# Altium project Olimp_hub_short.PrjPcb
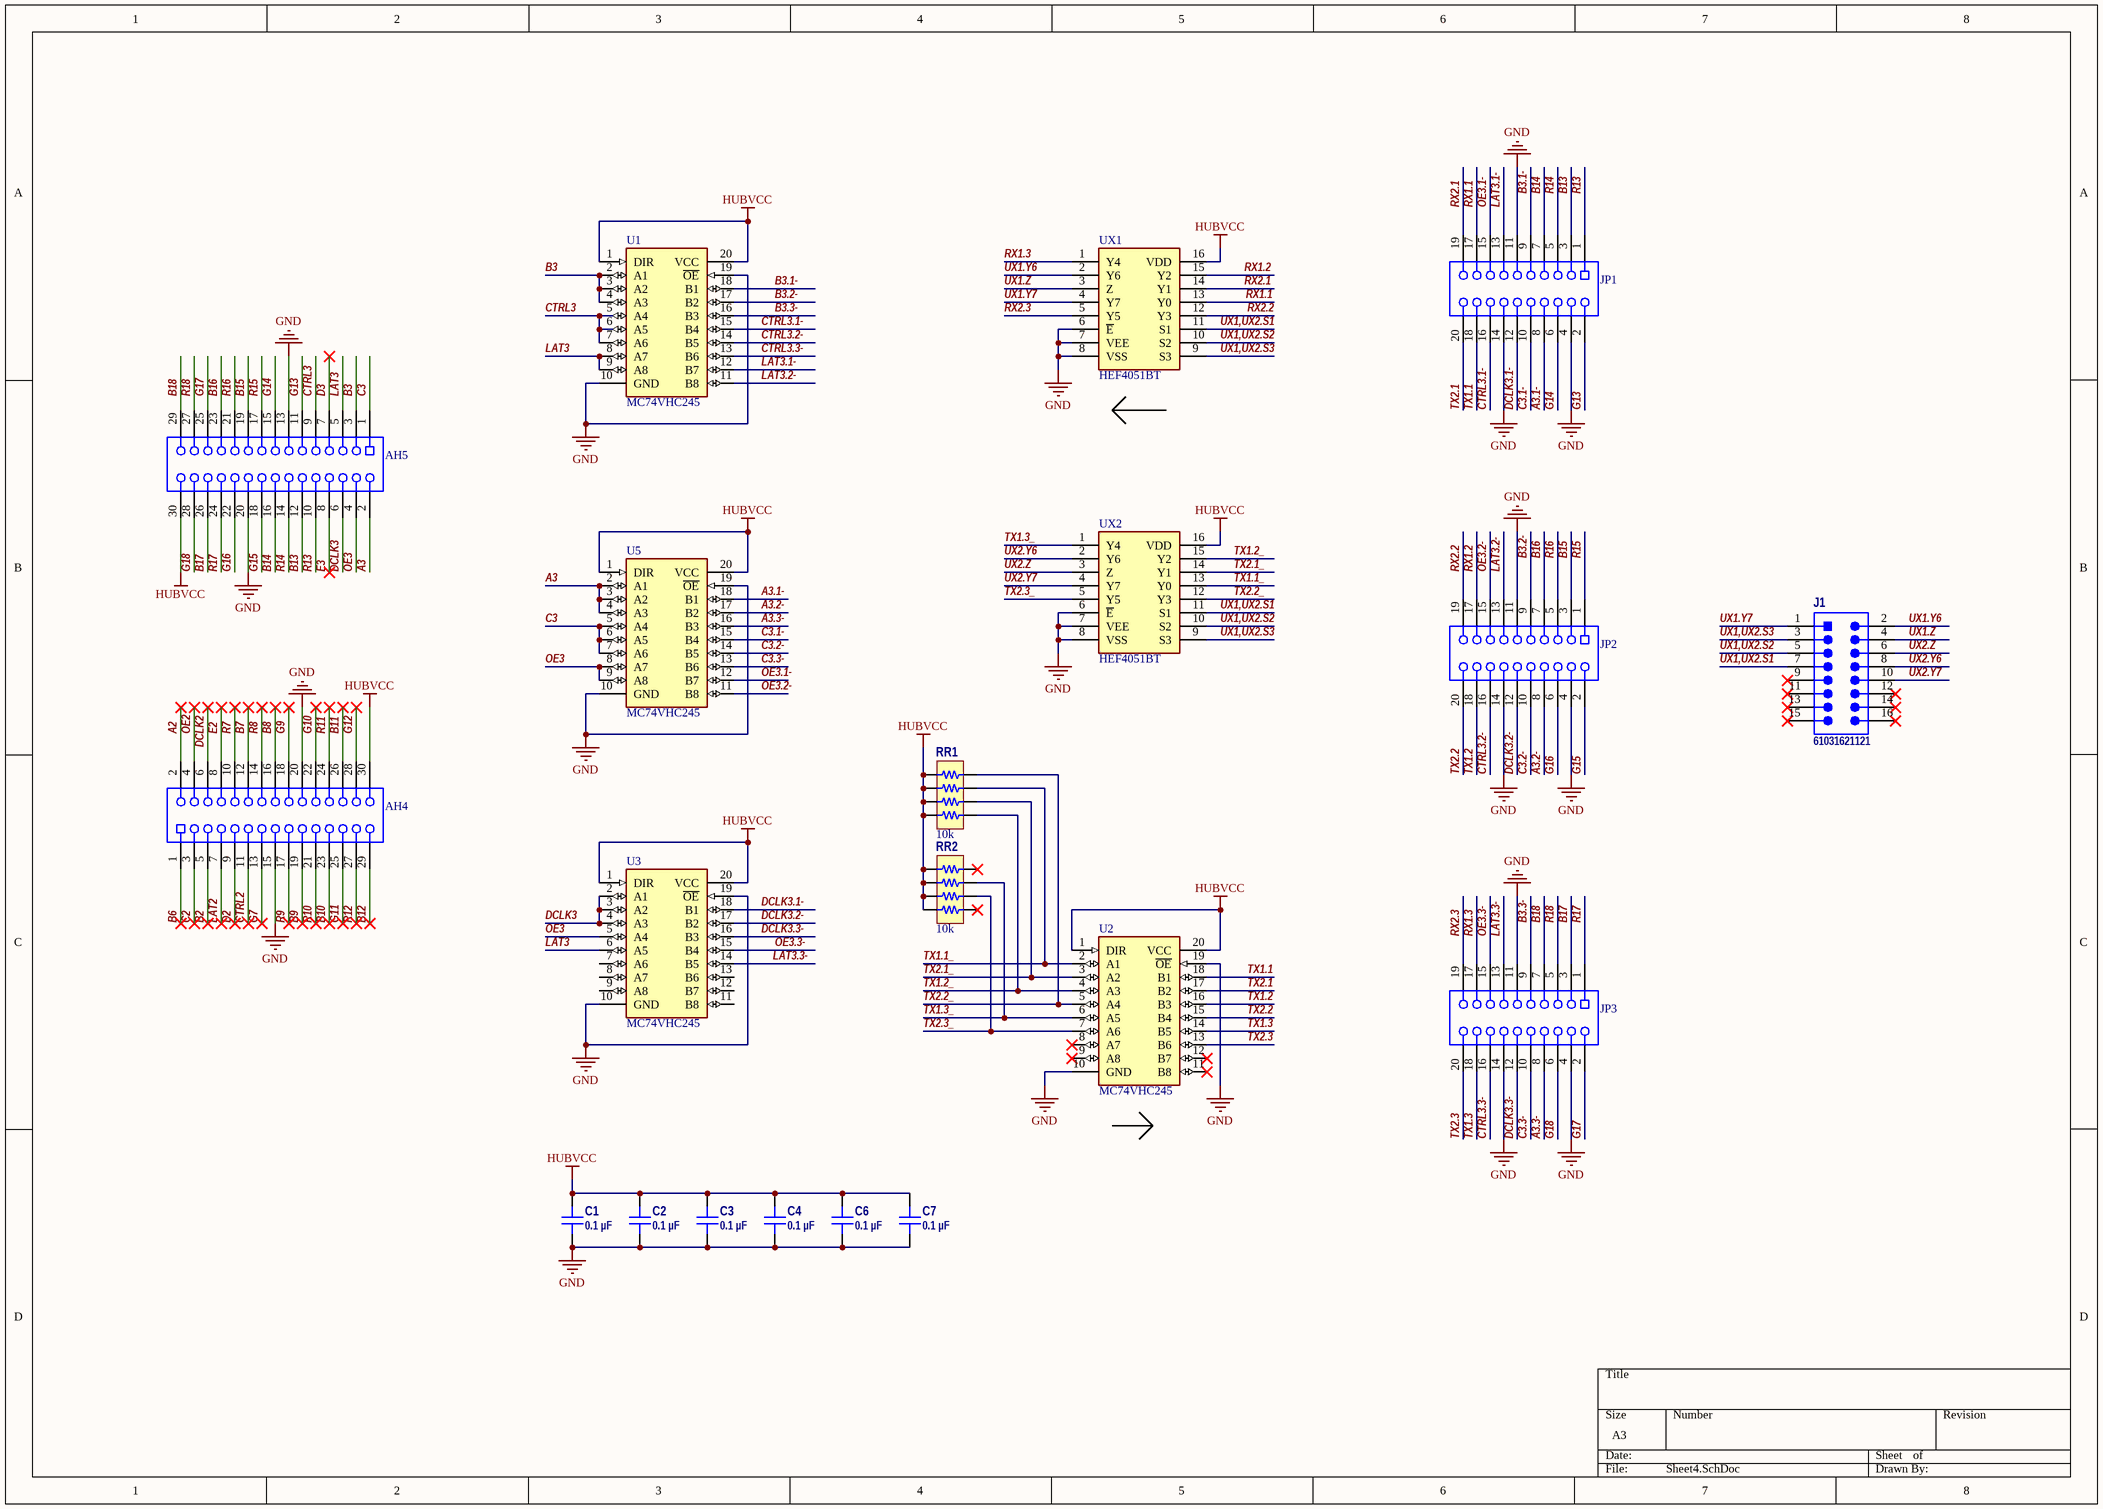
[diagram p0: Sheet4.SchDoc]
1 sheet, 20 parts. Net scope: global (net labels, ports and power ports of the same name join across sheets).
Board file: PCB1.PcbDoc

## Sheet Sheet4.SchDoc
size A3; SheetNumber: 1; SheetTotal: 1

### Parts
AH4  61003021821  [61003021821]  (value not drawn)
AH5  61003021821  [61003021821]  (value not drawn)
C1  0.1 µF  [CAP 0603_1608]
C2  0.1 µF  [CAP 0603_1608]
C3  0.1 µF  [CAP 0603_1608]
C4  0.1 µF  [CAP 0603_1608]
C6  0.1 µF  [CAP 0603_1608]
C7  0.1 µF  [CAP 0603_1608]
J1  61031621121  [61031621121]
JP1  61002021821  [61002021821]  (value not drawn)
JP2  61002021821  [61002021821]  (value not drawn)
JP3  61002021821  [61002021821]  (value not drawn)
RR1  Resistance (Ohms): 10k  [RESNET 0804-8 CONVEX]  (hidden comment: YC124-JR-0710KL)
RR2  Resistance (Ohms): 10k  [RESNET 0804-8 CONVEX]  (hidden comment: YC124-JR-0710KL)
U1  MC74VHC245  [SOP65P640X120-20N]
U2  MC74VHC245  [SOP65P640X120-20N]
U3  MC74VHC245  [SOP65P640X120-20N]
U5  MC74VHC245  [SOP65P640X120-20N]
UX1  HEF4051BT  [SOIC127P600X175-16N]
UX2  HEF4051BT  [SOIC127P600X175-16N]

### Nets
GND: AH4.15 AH4.20 AH5.13 AH5.20 C1.2 C2.2 C3.2 C4.2 C6.2 C7.2 JP1.4 JP1.11 JP1.14 JP2.4 JP2.11 JP2.14 JP3.4 JP3.11 JP3.14 U1.10(GND) U1.19(~{OE}) U2.10(GND) U2.19(~{OE}) U3.10(GND) U3.19(~{OE}) U5.10(GND) U5.19(~{OE}) UX1.6(~{E}) UX1.7(VEE) UX1.8(VSS) UX2.6(~{E}) UX2.7(VEE) UX2.8(VSS)
HUBVCC: AH4.30 AH5.30 C1.1 C2.1 C3.1 C4.1 C6.1 C7.1 RR1.5 RR1.6 RR1.7 RR1.8 RR2.5 RR2.6 RR2.7 RR2.8 U1.1(DIR) U1.20(VCC) U2.1(DIR) U2.20(VCC) U3.1(DIR) U3.20(VCC) U5.1(DIR) U5.20(VCC) UX1.16(VDD) UX2.16(VDD)
A2: AH4.2
A3: AH5.2 U5.2(A1) U5.3(A2) U5.4(A3)
A3.1-: JP1.8 U5.18(B1)
A3.2-: JP2.8 U5.17(B2)
A3.3-: JP3.8 U5.16(B3)
B2: AH4.5
B3: AH5.3 U1.2(A1) U1.3(A2) U1.4(A3)
B3.1-: JP1.9 U1.18(B1)
B3.2-: JP2.9 U1.17(B2)
B3.3-: JP3.9 U1.16(B3)
B6: AH4.1
B7: AH4.12
B8: AH4.16
B9: AH4.19
B10: AH4.23
B11: AH4.26
B12: AH4.29
B13: AH5.12 JP1.3
B14: AH5.16 JP1.7
B15: AH5.19 JP2.3
B16: AH5.23 JP2.7
B17: AH5.26 JP3.3
B18: AH5.29 JP3.7
C2: AH4.3
C3: AH5.1 U5.5(A4) U5.6(A5) U5.7(A6)
C3.1-: JP1.10 U5.15(B4)
C3.2-: JP2.10 U5.14(B5)
C3.3-: JP3.10 U5.13(B6)
CTRL2: AH4.11
CTRL3: AH5.9 U1.5(A4) U1.6(A5) U1.7(A6)
CTRL3.1-: JP1.16 U1.15(B4)
CTRL3.2-: JP2.16 U1.14(B5)
CTRL3.3-: JP3.16 U1.13(B6)
D2: AH4.9
D3: AH5.7
DCLK2: AH4.6
DCLK3: AH5.6 U3.2(A1) U3.3(A2) U3.4(A3)
DCLK3.1-: JP1.12 U3.18(B1)
DCLK3.2-: JP2.12 U3.17(B2)
DCLK3.3-: JP3.12 U3.16(B3)
E2: AH4.8
E3: AH5.8
G7: AH4.13
G9: AH4.18
G10: AH4.22
G11: AH4.25
G12: AH4.28
G13: AH5.11 JP1.2
G14: AH5.15 JP1.6
G15: AH5.18 JP2.2
G16: AH5.22 JP2.6
G17: AH5.25 JP3.2
G18: AH5.28 JP3.6
LAT2: AH4.7
LAT3: AH5.5 U1.8(A7) U1.9(A8) U3.6(A5)
LAT3.1-: JP1.13 U1.12(B7)
LAT3.2-: JP2.13 U1.11(B8)
LAT3.3-: JP3.13 U3.14(B5)
OE2: AH4.4
OE3: AH5.4 U3.5(A4) U5.8(A7) U5.9(A8)
OE3.1-: JP1.15 U5.12(B7)
OE3.2-: JP2.15 U5.11(B8)
OE3.3-: JP3.15 U3.15(B4)
R7: AH4.10
R8: AH4.14
R9: AH4.17
R10: AH4.21
R11: AH4.24
R12: AH4.27
R13: AH5.10 JP1.1
R14: AH5.14 JP1.5
R15: AH5.17 JP2.1
R16: AH5.21 JP2.5
R17: AH5.24 JP3.1
R18: AH5.27 JP3.5
RX1.1: JP1.17 UX1.13(Y0)
RX1.2: JP2.17 UX1.15(Y2)
RX1.3: JP3.17 UX1.1(Y4)
RX2.1: JP1.19 UX1.14(Y1)
RX2.2: JP2.19 UX1.12(Y3)
RX2.3: JP3.19 UX1.5(Y5)
TX1.1: JP1.18 U2.18(B1)
TX1.1_: RR1.3 U2.2(A1) UX2.13(Y0)
TX1.2: JP2.18 U2.16(B3)
TX1.2_: RR1.1 U2.4(A3) UX2.15(Y2)
TX1.3: JP3.18 U2.14(B5)
TX1.3_: RR2.3 U2.6(A5) UX2.1(Y4)
TX2.1: JP1.20 U2.17(B2)
TX2.1_: RR1.2 U2.3(A2) UX2.14(Y1)
TX2.2: JP2.20 U2.15(B4)
TX2.2_: RR1.4 U2.5(A4) UX2.12(Y3)
TX2.3: JP3.20 U2.13(B6)
TX2.3_: RR2.2 U2.7(A6) UX2.5(Y5)
UX1,UX2.S1: J1.7 UX1.11(S1) UX2.11(S1)
UX1,UX2.S2: J1.5 UX1.10(S2) UX2.10(S2)
UX1,UX2.S3: J1.3 UX1.9(S3) UX2.9(S3)
UX1.Y6: J1.2 UX1.2(Y6)
UX1.Y7: J1.1 UX1.4(Y7)
UX1.Z: J1.4 UX1.3(Z)
UX2.Y6: J1.8 UX2.2(Y6)
UX2.Y7: J1.10 UX2.4(Y7)
UX2.Z: J1.6 UX2.3(Z)

Not connected (* = marked no-connect by the designer): J1 9* 11* 12* 13* 14* 15* 16*; RR2 1* 4*; U2 8(A7)* 9(A8)* 11(B8)* 12(B7)*; U3 7(A6) 8(A7) 9(A8) 11(B8) 12(B7) 13(B6)

### Library data of the parts
AH4 AH5 = 61003021821: WR-PHD Socket Header, SMT, pitch 2.54mm, Dual Row, Vertical, 30p; Manufacturer: Wurth Elektronik; Pin Number: 30; Rated Current: 3A; Working Voltage: 250VAC; Withstanding Voltage: 600VAC; Contact Resistance: 20mOhm; ComponentLink1Description: Manufacturer; ComponentLink1URL: http://www.we-online.de; ComponentLink2Description: Datasheet; ComponentLink2URL: https://www.we-online.com/catalog/datasheet/61003021821.pdf; Manufacturer Part Number: 61003021821; Pitch: 2.54mm; Operating Temperature: -40 to +105degC; Mounting Technology: SMT; Packaging: Tube; Gender: Socket Header; Row Number: Dual; Orientation: Vertical
C1-C4 C6 C7 = CC0603MRX7R8BB104: CAP CER 0.1UF 25V X7R 0603; manufacturer: Yageo; Tolerance: ±20%; Part Number: CC0603MRX7R8BB104; Value: 0.1 µF; Applications: General Purpose; Capacitance: 0.1 µF; componentlink1description: Datasheet; componentlink1url: https://www.yageo.com/upload/media/product/productsearch/datasheet/mlcc/UPY-GPHC_X7R_6.3V-to-50V_18.pdf; componentlink2description: DigiKey Link; componentlink2url: https://www.digikey.com/en/products/detail/yageo/CC0603MRX7R8BB104/5195232; Device Package: 0603 (1608 Metric); lastupdated: 25.01.2023 20:08:27; Lifecycle Status: Active; Minimum Order: 1; Mounting Type: Surface Mount, MLCC; Operating Temperature: -55°C ~ 125°C; Package / Case: 0603 (1608 Metric); packaging: TapeAndReel; partid: 9477; Part Status: Active; price: 0.01; series: CC; Size / Dimension: 0.063" L x 0.031" W (1.60mm x 0.80mm); Supplier 1: DigiKey; Supplier Part Number 1: 311-1825-1-ND; Temperature Coefficient: X7R; Thickness (Max): 0.035" (0.90mm); Voltage - Rated: 25V
J1 = 61031621121: WR-PHD Pin Header, SMT, pitch 2.54mm, Dual Row, Vertical, 16p; Manufacturer: Wurth Elektronik; Pin Number: 16; Rated Current: 3A; Working Voltage: 250VAC; Withstanding Voltage: 500VAC; Contact Resistance: 20mOhm; ComponentLink1Description: Manufacturer; ComponentLink1URL: http://www.we-online.de; ComponentLink2Description: Datasheet; ComponentLink2URL: https://www.we-online.com/catalog/datasheet/61031621121.pdf; Manufacturer Part Number: 61031621121; Pitch: 2.54mm; Operating Temperature: -40 to +125degC; Mounting Technology: SMT; Packaging: Tape and Reel; Gender: Pin Header; Row Number: Dual; Orientation: Vertical
JP1-JP3 = 61002021821: WR-PHD Socket Header, SMT, pitch 2.54mm, Dual Row, Vertical, 20p; Manufacturer: Wurth Elektronik; Pin Number: 20; Rated Current: 3A; Working Voltage: 250VAC; Withstanding Voltage: 600VAC; Contact Resistance: 20mOhm; ComponentLink1Description: Manufacturer; ComponentLink1URL: http://www.we-online.de; ComponentLink2Description: Datasheet; ComponentLink2URL: https://www.we-online.com/catalog/datasheet/61002021821.pdf; Manufacturer Part Number: 61002021821; Pitch: 2.54mm; Operating Temperature: -40 to +105degC; Mounting Technology: SMT; Packaging: Tube; Gender: Socket Header; Row Number: Dual; Orientation: Vertical
RR1 RR2 = YC124-JR-0710KL: RES ARRAY 4 RES 10K OHM 0804; Manufacturer: Yageo; Circuit Type: Isolated; Number of Resistors: 4; Power Per Element: 62.5mW; Temperature Coefficient: ±200ppm/°C; Tolerance: ±5%; Part Number: YC124-JR-0710KL; Applications: Automotive AEC-Q200, DDRAM, SDRAM; ComponentLink1Description: Datasheet; ComponentLink1URL: https://www.yageo.com/upload/media/product/productsearch/datasheet/rchip/PYu-YC_TC_group_51_RoHS_L_9.pdf; ComponentLink2Description: DigiKey Link; ComponentLink2URL: https://www.digikey.com/en/products/detail/yageo/YC124-JR-0710KL/1005019; Height - Seated (Max): 0.022" (0.55mm); LastUpdated: 19.09.2022 13:54:50; Lifecycle Status: Active; Minimum Order: 1; Mounting Type: Surface Mount; Number of Pins: 8; Operating Temperature: -55°C ~ 155°C; Package / Case: 0804, Convex, Long Side Terminals; Packaging: TapeAndReel; PartId: 471; Part Status: Active; Price: 0.01; Series: YC124; Size / Dimension: 0.079" L x 0.039" W (2.00mm x 1.00mm); Supplier 1: DigiKey; Supplier Part Number 1: YC124J-10KCT-ND
U1-U3 U5 = MC74VHC245DTG: Integrated Circuit; Manufacturer_Name: onsemi; Datasheet Link: https://componentsearchengine.com/Datasheets/1/MC74VHC245DTG.pdf; Height: 1.2mm; Manufacturer_Part_Number: MC74VHC245DTG; Mouser Part Number: 863-MC74VHC245DTG; Mouser Price/Stock: https://www.mouser.com/Search/Refine.aspx?Keyword=863-MC74VHC245DTG; Arrow Part Number: MC74VHC245DTG; Arrow Price/Stock: https://www.arrow.com/en/products/mc74vhc245dtg/on-semiconductor
UX1 UX2 = HEF4051BT: Integrated Circuit; Manufacturer_Name: Nexperia; Datasheet Link: https://www.digikey.com/product-detail/en/nexperia-usa-inc/HEF4051BT-Q100118/1727-1040-1-ND/3749047; Height: 1.75mm; Manufacturer_Part_Number: HEF4051BT; Mouser Part Number: N/A; Mouser Price/Stock: https://www.mouser.com/Search/Refine.aspx?Keyword=N%2FA